# Altium schematic sheet Audio.SchDoc
size A4
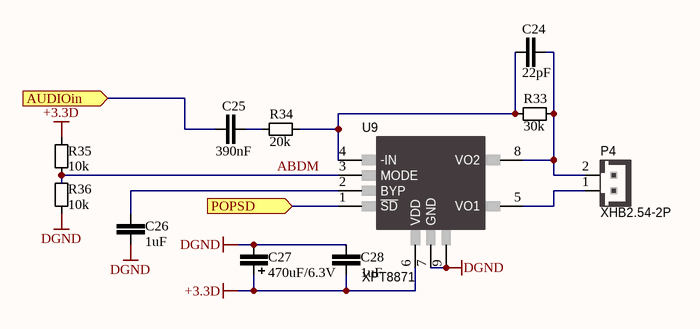
[diagram p0: Audio.SchDoc]

## Parts
C24  value 22pF  [0603-C]  (hidden comment: Cap)
C25  value 390nF  [0603-C]  (hidden comment: Cap)
C26  value 1uF  [0603-C]  (hidden comment: Cap)
C27  value 470uF/6.3V  [C-E-ALU-8X5]  (hidden comment: ECap)
C28  value 1uF  [0603-C]  (hidden comment: Cap)
P4  XHB2.54-2P  [XH-2]
R33  value 30k  [0603-R]  (hidden comment: Res)
R34  value 20k  [0603-R]  (hidden comment: Res)
R35  value 10k  [0603-R]  (hidden comment: Res)
R36  value 10k  [0603-R]  (hidden comment: Res)
U9  XPT8871  [SO-8_POWERPAD]

## Ports
AUDIOin (in), POPSD (in)

## Nets
+3.3D: C27.1 C28.2 R35.1 U9.6(VDD)
DGND: C26.2 C27.2 C28.1 R36.2 U9.7(GND) U9.9
ABDM: R35.2 R36.1 U9.3(MODE)
AUDIOin: C25.1 ; port AUDIOin
POPSD: U9.1(~{SD}) ; port POPSD
NetC24_1: C24.1 R33.1 R34.2 U9.4(-IN)
NetC24_2: C24.2 P4.2 R33.2 U9.8(VO2)
NetC25_2: C25.2 R34.1
NetC26_1: C26.1 U9.2(BYP)
NetP4_1: P4.1 U9.5(VO1)

## Library data of the parts
C24 = C11C022PJ1H0: MLCC 22pF 5% 50V NPO 0603; TemperatureRange: -55°C to 150°C; VenderID: MLCC-0603-50V-220J-NPO; Published: 1-Jun-2017; Publisher: GreenBox; MountType: SMT; PackageReference: 0603; Manufacturer: *
C25 = C21C390NK1H0: MLCC 390nF 10% 50V X7R 0603; TemperatureRange: -55°C to 150°C; VenderID: MLCC-0603-50V-394K-X7R; Published: 1-Jun-2017; Publisher: GreenBox; MountType: SMT; PackageReference: 0603; Manufacturer: *
C26 C28 = C21C001UK1C0: MLCC 1uF 10% 16V X7R 0603; TemperatureRange: -55°C to 150°C; VenderID: MLCC-0603-16V-105K-X7R; Published: 1-Jun-2017; Publisher: GreenBox; MountType: SMT; PackageReference: 0603; Manufacturer: *
C27 = C3AD470UM0J0: DIP ECAP 470uF 20% 6.3V 8X5; TemperatureRange: -40°C to 105°C; VenderID: 470uF/6.3V 20% 8X5; Published: 1-Jun-2017; Publisher: GreenBox; MountType: DIP; PackageReference: 8X5; Manufacturer: *
P4 = P6DX02Z25400: Header XHB2.54-2P 2.54mm; TemperatureRange: -25 to 85°C; Manufacturer: *; MountType: DIP; PackageReference: XH2.54-2P; Published: 1-Jun-2017; Publisher: GreenBox; VenderID: XHB2.54-2P
R33 = R11C030KFBF0: SMD Resistor 30k 1% 1/10W 0603 100PPM; TemperatureRange: -55°C to 150°C; VenderID: RES-0603-30k-1%; Published: 1-Jun-2017; Publisher: GreenBox; MountType: SMT; PackageReference: 0603; Manufacturer: *
R34 = R11C020KFBF0: SMD Resistor 20k 1% 1/10W 0603 100PPM; TemperatureRange: -55°C to 150°C; VenderID: RES-0603-20k-1%; Published: 1-Jun-2017; Publisher: GreenBox; MountType: SMT; PackageReference: 0603; Manufacturer: *
R35 R36 = R11C010KFBF0: SMD Resistor 10k 1% 1/10W 0603 100PPM; TemperatureRange: -55°C to 150°C; VenderID: RES-0603-10k-1%; Published: 1-Jun-2017; Publisher: GreenBox; MountType: SMT; PackageReference: 0603; Manufacturer: *
U9 = U1S1XPT88713: 1 channel audio amplifier XPT8871 5W; Manufacturer: XPTEK; TemperatureRange: -40 to 85°C; MountType: SMT; PackageReference: SOIC-8; Published: 1-Jun-2017; Publisher: GreenBox; VenderID: XPT8871